# Altium project MiniBox.PrjPcb
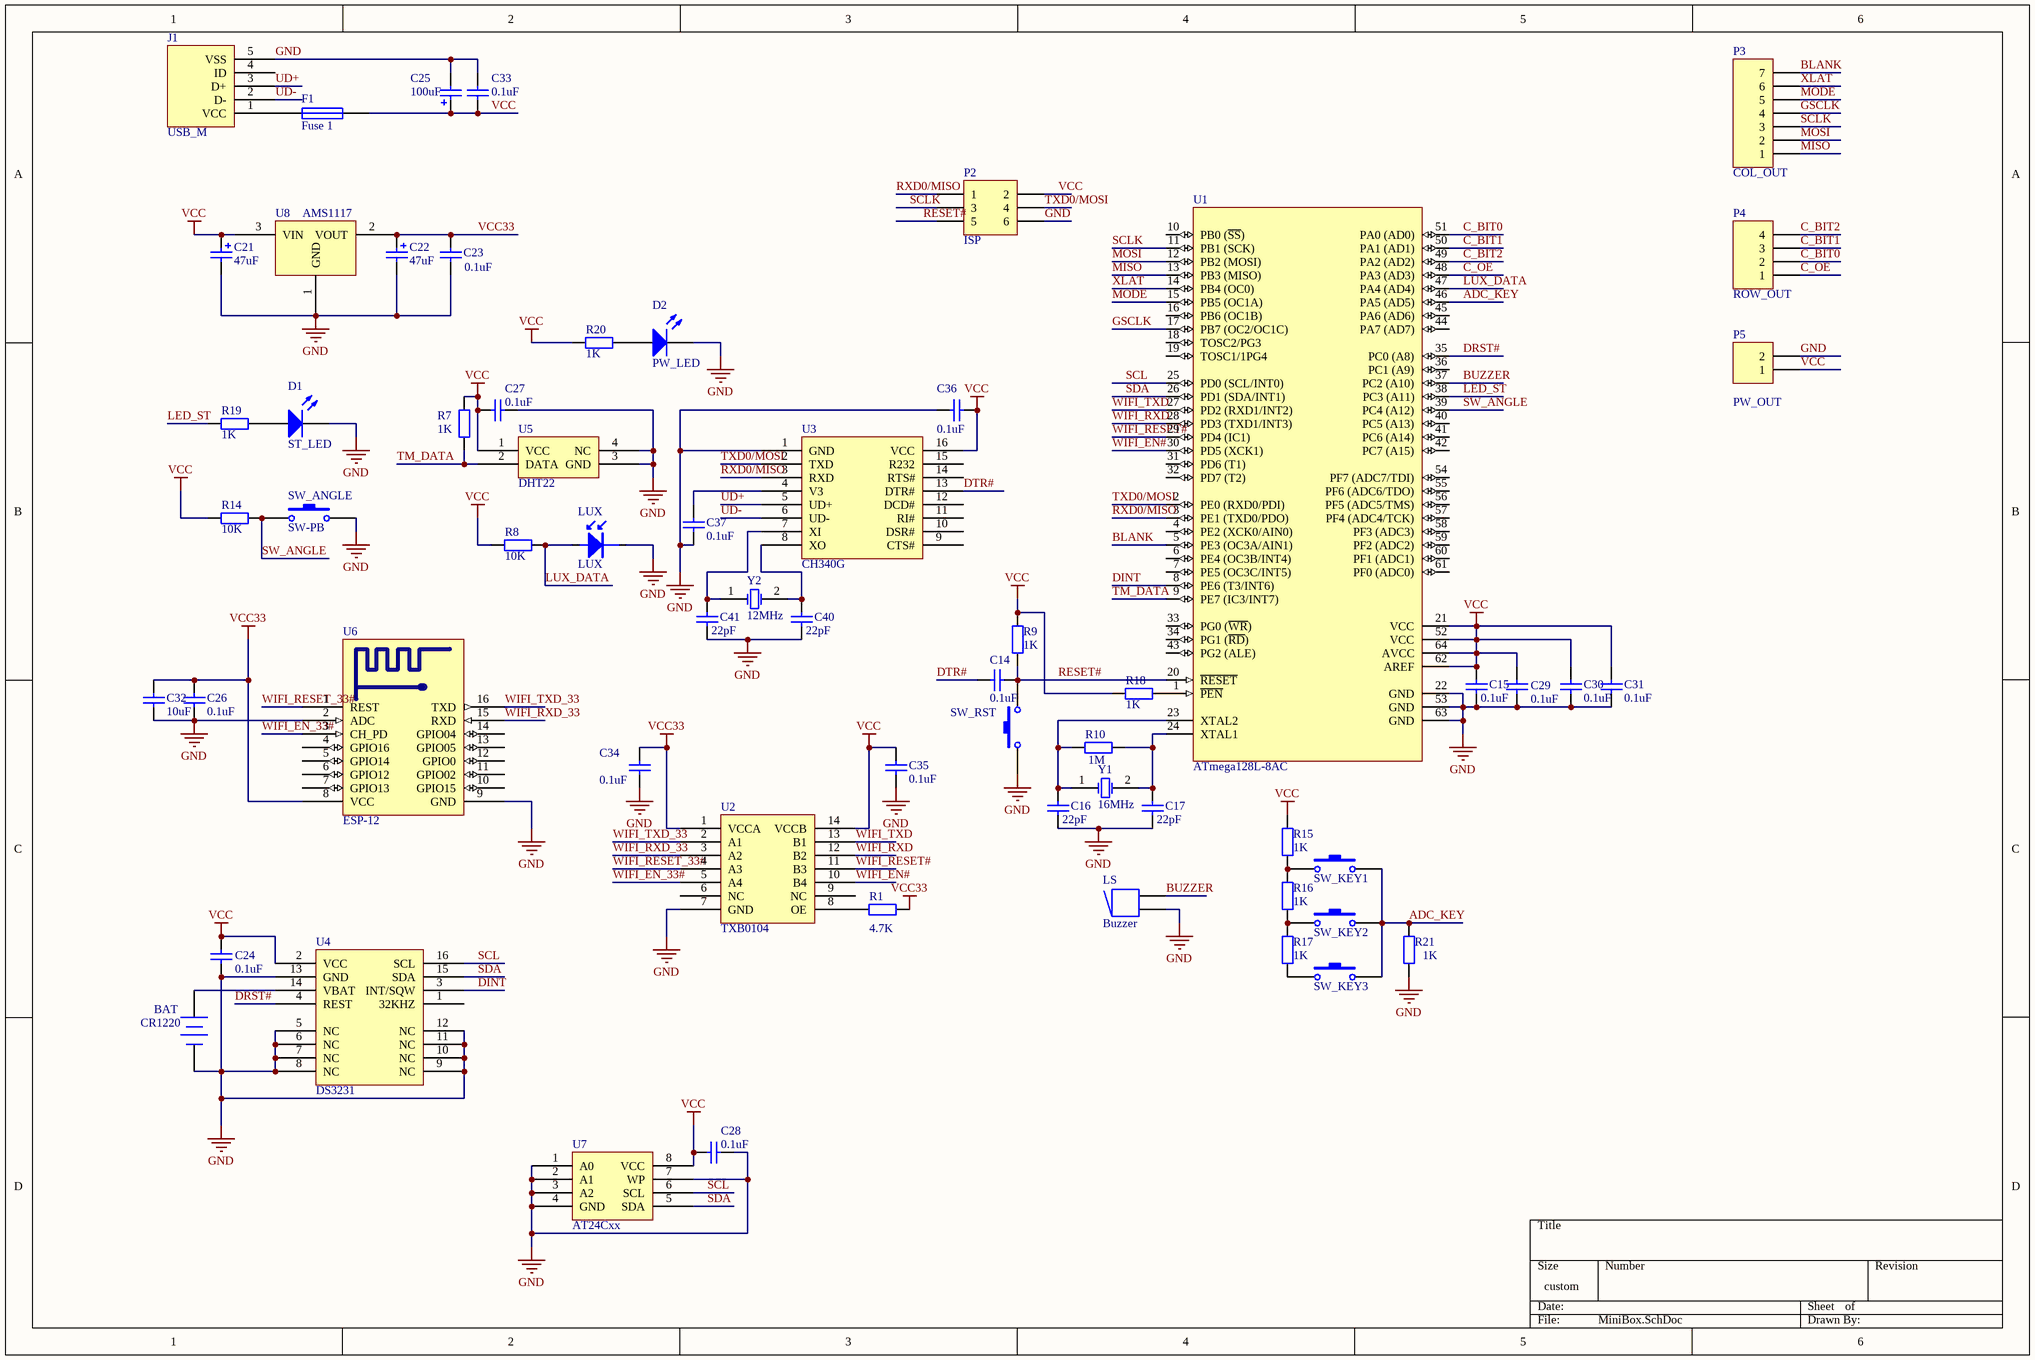
[diagram p0: MiniBox.SchDoc]
1 sheet, 62 parts. Net scope: hierarchical (ports join the sheet entries above them; power ports are global).
Board file: MiniBox.PcbDoc

## Sheet MiniBox.SchDoc
size 381 x 254 mm; PageSetup: Record=PageOptions|CenterHorizontal=True|CenterVertical=True|PrintScale=0.72|XCorrection=1.00|YCorrection=1.00|PrintKind=1|BorderSize=5000000|LeftOffset=0|BottomOffset=0|Orientation=2|PaperLength=1000|PaperWidth=1000|Scale=100|PaperSource=257|PrintQuality=600|MediaType=1|DitherType=10|PrintScaleMode=1|PaperKind=Letter|PaperIndex=1

### Parts
BAT  CR1220  [CR1220]
C14  value 0.1uF  [C-0805]  (hidden comment: Cap)
C15  value 0.1uF  [C-0805]  (hidden comment: Cap)
C16  value 22pF  [C-0805]  (hidden comment: Cap)
C17  value 22pF  [C-0805]  (hidden comment: Cap)
C21  value 47uF  [CAP-3528]  (hidden comment: Cap Pol2)
C22  value 47uF  [CAP-3528]  (hidden comment: Cap Pol2)
C23  value 0.1uF  [C-0805]  (hidden comment: Cap)
C24  value 0.1uF  [C-0805]  (hidden comment: Cap)
C25  value 100uF  [CAPAE-D]  (hidden comment: Cap Pol2)
C26  value 0.1uF  [C-0805]  (hidden comment: Cap)
C27  value 0.1uF  [C-0805]  (hidden comment: Cap)
C28  value 0.1uF  [C-0805]  (hidden comment: Cap)
C29  value 0.1uF  [C-0805]  (hidden comment: Cap)
C30  value 0.1uF  [C-0805]  (hidden comment: Cap)
C31  value 0.1uF  [C-0805]  (hidden comment: Cap)
C32  value 10uF  [C-0805]  (hidden comment: Cap)
C33  value 0.1uF  [C-0805]  (hidden comment: Cap)
C34  value 0.1uF  [C-0805]  (hidden comment: Cap)
C35  value 0.1uF  [C-0805]  (hidden comment: Cap)
C36  value 0.1uF  [C-0805]  (hidden comment: Cap)
C37  value 0.1uF  [C-0805]  (hidden comment: Cap)
C40  value 22pF  [C-0805]  (hidden comment: Cap)
C41  value 22pF  [C-0805]  (hidden comment: Cap)
D1  ST_LED  [LED-0805]
D2  PW_LED  [LED-0805]
F1  Fuse 1  [0805-1]
J1  USB_M  [USB_MICRO_5S_B]
LS  Buzzer  [BEEP-S]
LUX  LUX
P2  ISP  [HDR2X3]
P3  COL_OUT  [HDR1X7]
P4  ROW_OUT  [HDR1X4]
P5  PW_OUT  [HDR1X2]
R1  value 4.7K  [0805-1]  (hidden comment: Res2)
R7  value 1K  [0805-1]  (hidden comment: Res2)
R8  value 10K  [0805-1]  (hidden comment: Res2)
R9  value 1K  [0805-1]  (hidden comment: Res2)
R10  value 1M  [0805-1]  (hidden comment: Res2)
R14  value 10K  [0805-1]  (hidden comment: Res2)
R15  value 1K  [0805-1]  (hidden comment: Res2)
R16  value 1K  [0805-1]  (hidden comment: Res2)
R17  value 1K  [0805-1]  (hidden comment: Res2)
R18  value 1K  [0805-1]  (hidden comment: Res2)
R19  value 1K  [0805-1]  (hidden comment: Res2)
R20  value 1K  [0805-1]  (hidden comment: Res2)
R21  value 1K  [0805-1]  (hidden comment: Res2)
SW_ANGLE  SW-PB  [AX_2.54]
SW_KEY1  SW-PB  [SW_B]  (value not drawn)
SW_KEY2  SW-PB  [SW_B]  (value not drawn)
SW_KEY3  SW-PB  [SW_B]  (value not drawn)
SW_RST  SW-PB  [SW_B]  (value not drawn)
U1  ATmega128L-8AC  [64A_N]
U2  TXB0104  [TSSOP-14]
U3  CH340G  [SOIC-16]
U4  DS3231  [SOIC-16W]
U5  DHT22  [DHTxx]
U6  ESP-12  [ESP_12]
U7  AT24Cxx  [SOIC-8]
U8  AMS1117  [SOT223]
Y1  16MHz  [X-SM49]
Y2  12MHz  [X-SM49]

### Nets
GND: BAT.2(-) C15.1 C16.1 C17.1 C21.2 C22.2 C23.1 C24.1 C25.2 C26.1 C27.1 C28.1 C29.2 C30.2 C31.2 C32.1 C33.2 C34.2 C35.2 C36.1 C37.1 C40.1 C41.1 D1.2(K) D2.2(K) J1.5(VSS) LS.1 LUX.2 P2.6 P5.2 R21.2 SW_ANGLE.2 SW_RST.1 U1.22(GND) U1.53(GND) U1.63(GND) U2.7(GND) U3.1(GND) U4.5(NC) U4.6(NC) U4.7(NC) U4.8(NC) U4.9(NC) U4.10(NC) U4.11(NC) U4.12(NC) U4.13(GND) U5.3(GND) U5.4(NC) U6.2(ADC) U6.9(GND) U7.1(A0) U7.2(A1) U7.3(A2) U7.4(GND) U7.7(WP) U8.1(GND)
VCC: C15.2 C21.1 C24.2 C25.1 C27.2 C28.2 C29.1 C30.1 C31.1 C33.1 C35.1 C36.2 F1.2 P2.2 P5.1 R7.2 R8.2 R9.2 R14.2 R15.2 R18.2 R20.2 U1.21(VCC) U1.52(VCC) U1.62(AREF) U1.64(AVCC) U2.14(VCCB) U3.16(VCC) U4.2(VCC) U5.1(VCC) U7.8(VCC) U8.3(VIN)
VCC33: C22.1 C23.2 C26.2 C32.2 C34.1 R1.2 U2.1(VCCA) U6.8(VCC) U8.2(VOUT)
ADC_KEY: R21.1 SW_KEY1.2 SW_KEY2.2 SW_KEY3.2 U1.46(PA5_(AD5))
BLANK: P3.7 U1.5(PE3_(OC3A/AIN1))
BUZZER: LS.2 U1.37(PC2_(A10))
C_BIT0: P4.2 U1.51(PA0_(AD0))
C_BIT1: P4.3 U1.50(PA1_(AD1))
C_BIT2: P4.4 U1.49(PA2_(AD2))
C_OE: P4.1 U1.48(PA3_(AD3))
DINT: U1.8(PE6_(T3/INT6)) U4.3(INT/SQW)
DRST#: U1.35(PC0_(A8)) U4.4(REST)
DTR#: C14.1 U3.13(DTR#)
GSCLK: P3.4 U1.17(PB7_(OC2/OC1C))
LED_ST: R19.2 U1.38(PC3_(A11))
LUX_DATA: LUX.1 R8.1 U1.47(PA4_(AD4))
MISO: P3.1 U1.13(PB3_(MISO))
MODE: P3.5 U1.15(PB5_(OC1A))
MOSI: P3.2 U1.12(PB2_(MOSI))
RESET#: C14.2 P2.5 R9.1 SW_RST.2 U1.20(~{RESET})
RXD0/MISO: P2.1 U1.3(PE1_(TXD0/PDO)) U3.3(RXD)
SCL: U1.25(PD0_(SCL/INT0)) U4.16(SCL) U7.6(SCL)
SCLK: P2.3 P3.3 U1.11(PB1_(SCK))
SDA: U1.26(PD1_(SDA/INT1)) U4.15(SDA) U7.5(SDA)
SW_ANGLE: R14.1 SW_ANGLE.1 U1.39(PC4_(A12))
TM_DATA: R7.1 U1.9(PE7_(IC3/INT7)) U5.2(DATA)
TXD0/MOSI: P2.4 U1.2(PE0_(RXD0/PDI)) U3.2(TXD)
UD+: J1.3(D+) U3.5(UD+)
UD-: J1.2(D-) U3.6(UD-)
WIFI_EN#: U1.30(PD5_(XCK1)) U2.10(B4)
WIFI_EN_33#: U2.5(A4) U6.3(CH_PD)
WIFI_RESET#: U1.29(PD4_(IC1)) U2.11(B3)
WIFI_RESET_33#: U2.4(A3) U6.1(REST)
WIFI_RXD: U1.28(PD3_(TXD1/INT3)) U2.12(B2)
WIFI_RXD_33: U2.3(A2) U6.15(RXD)
WIFI_TXD: U1.27(PD2_(RXD1/INT2)) U2.13(B1)
WIFI_TXD_33: U2.2(A1) U6.16(TXD)
XLAT: P3.6 U1.14(PB4_(OC0))
NetBAT_1: BAT.1(+) U4.14(VBAT)
NetC16_2: C16.2 R10.1 U1.23(XTAL2) Y1.1(OSC1)
NetC17_2: C17.2 R10.2 U1.24(XTAL1) Y1.2(OSC2)
NetC37_2: C37.2 U3.4(V3)
NetC40_2: C40.2 U3.8(XO) Y2.2(OSC2)
NetC41_2: C41.2 U3.7(XI) Y2.1(OSC1)
NetD1_1: D1.1(A) R19.1
NetD2_1: D2.1(A) R20.1
NetF1_1: F1.1 J1.1(VCC)
NetR1_1: R1.1 U2.8(OE)
NetR15_1: R15.1 R16.2 SW_KEY1.1
NetR16_1: R16.1 R17.2 SW_KEY2.1
NetR17_1: R17.1 SW_KEY3.1
NetR18_1: R18.1 U1.1(~{PEN})

Not connected (* = marked no-connect by the designer): J1 4(ID); U1 4(PE2_(XCK0/AIN0)) 6(PE4_(OC3B/INT4)) 7(PE5_(OC3C/INT5)) 10(PB0_(~{SS})) 16(PB6_(OC1B)) 18(TOSC2/PG3) 19(TOSC1/1PG4) 31(PD6_(T1)) 32(PD7_(T2)) 33(PG0_(~{WR})) 34(PG1_(~{RD})) 36(PC1_(A9)) 40(PC5_(A13)) 41(PC6_(A14)) 42(PC7_(A15)) 43(PG2_(ALE)) 44(PA7_(AD7)) 45(PA6_(AD6)) 54(PF7_(ADC7/TDI)) 55(PF6_(ADC6/TDO)) 56(PF5_(ADC5/TMS)) 57(PF4_(ADC4/TCK)) 58(PF3_(ADC3)) 59(PF2_(ADC2)) 60(PF1_(ADC1)) 61(PF0_(ADC0)); U2 6(NC) 9(NC); U3 9(CTS#) 10(DSR#) 11(RI#) 12(DCD#) 14(RTS#) 15(R232); U4 1(32KHZ); U6 4(GPIO16) 5(GPIO14) 6(GPIO12) 7(GPIO13) 10(GPIO15) 11(GPIO02) 12(GPIO0) 13(GPIO05) 14(GPIO04)

### Library data of the parts
BAT = Battery: Multicell Battery; Published: 24-Mar-1999; LatestRevisionDate: 17-Jul-2002; LatestRevisionNote: Re-released for DXP Platform.; PackageReference: BAT-2; Publisher: Altium Limited; PackageDescription: Battery; 2 Leads
C14-C17 C23 C24 C26-C37 C40 C41 = Cap: Capacitor; Published: 8-Jun-2000; LatestRevisionDate: 17-Jul-2002; LatestRevisionNote: Re-released for DXP Platform.; PackageReference: RAD-0.3; Publisher: Altium Limited; PackageDescription: Radial Cap, Thru-Hole; 2 Leads; 0.3 in Pin Spacing
C21 C22 C25 = Cap Pol2: Polarized Capacitor (Axial); Published: 8-Jun-2000; LatestRevisionDate: 17-Jul-2002; LatestRevisionNote: Re-released for DXP Platform.; PackageReference: POLAR0.8; Publisher: Altium Limited; PackageDescription: Polarized Capacitor; 2 Leads
D1 D2 = LED2: Typical RED, GREEN, YELLOW, AMBER GaAs LED; Published: 8-Jun-2000; LatestRevisionDate: 17-Jul-2002; LatestRevisionNote: Re-released for DXP Platform.; PackageVersion: Feb-2002; PackageReference: 3.2X1.6X1.1; Publisher: Altium Limited; PackageDescription: SM LED; 2 Flat Leads
F1 = Fuse 1: Fuse; Published: 8-Jun-2000; LatestRevisionDate: 17-Jul-2002; LatestRevisionNote: Re-released for DXP Platform.; PackageReference: PIN-W2/E2.8; Publisher: Altium Limited; PackageDescription: Thru-Hole; 2 Leads
J1 = USB_M: Micro/Mini USB
LS = Buzzer: Magnetic Transducer Buzzer; Published: 24-Mar-1999; LatestRevisionDate: 17-Dec-2003; LatestRevisionNote: Schematic revised, PCB Footprint replaced.; DatasheetVersion: 17-Dec-2003; PackageReference: ABSM-1574; Publisher: Altium Limited; PackageDescription: Magnetic Transducer Buzzer; ComponentLink1Description: Manufacturer Link; ComponentLink1URL: http://www.megastar.com/linecard/buzzmode/index.php
P2 = Header 3X2: Header, 3-Pin, Dual row; LatestRevisionDate: 17-Jul-2002; LatestRevisionNote: Re-released for DXP Platform.; Publisher: Altium Limited
P3 = Header 7: Header, 7-Pin; LatestRevisionDate: 17-Jul-2002; LatestRevisionNote: Re-released for DXP Platform.; Publisher: Altium Limited
P4 = Header 4: Header, 4-Pin; LatestRevisionDate: 17-Jul-2002; LatestRevisionNote: Re-released for DXP Platform.; Publisher: Altium Limited
P5 = Header 2: Header, 2-Pin; LatestRevisionDate: 17-Jul-2002; LatestRevisionNote: Re-released for DXP Platform.; Publisher: Altium Limited
R1 R7-R10 R14-R21 = Res2: Resistor; Published: 8-Jun-2000; LatestRevisionDate: 17-Jul-2002; LatestRevisionNote: Re-released for DXP Platform.; PackageReference: AXIAL-0.4; Publisher: Altium Limited; PackageDescription: Axial Device, Thru-Hole; 2 Leads; 0.4 in Pin Spacing
SW_ANGLE SW_KEY1-SW_KEY3 SW_RST = SW-PB: Switch; Published: 24-Mar-1999; LatestRevisionDate: 17-Jul-2002; LatestRevisionNote: Re-released for DXP Platform.; PackageReference: SPST-2; Publisher: Altium Limited; PackageDescription: Switch; 2 Leads
U1 = ATmega128L-8AC: 8-Bit AVR Microcontroller with 128K Bytes of In-System Programmable Flash Memory; Published: 17-Sep-2003; LatestRevisionDate: 13-Apr-2006; LatestRevisionNote: IPC-7351 Footprint Added.; DatasheetVersion: 2467G-AVR-09/02; PackageVersion: revB, Oct-2001; PackageReference: 64A; Publisher: Altium Limited; PackageDescription: 64-Pin Thin Quad Flat Pack 0.8 mm Pitch; Code_JEDEC: MS-026-AEB; ComponentLink1Description: Manufacturer Link; ComponentLink1URL: http://www.atmel.com; ComponentLink2Description: Datasheet; ComponentLink2URL: http://www.atmel.com/dyn/resources/prod_documents/doc2467.pdf
Y1 Y2 = XTAL: Crystal Oscillator; Published: 8-Jun-2000; LatestRevisionDate: 17-Jul-2002; LatestRevisionNote: Re-released for DXP Platform.; PackageReference: R38; Publisher: Altium Limited; PackageDescription: Crystal, Thru-Hole; 2 Leads; Body 3.1 x 8.2 mm (Dia.xH)